# EasyEDA Pro project ProProject_USB-DAC-PRO_2024-02-27.epro, schematic DIGITAL

## Sheets
1 CT7601: Create Date: 2024-02-11; Page Name: CT7601; Project Name: USB-DAC-PRO; Schematic Name: DIGITAL; Update Date: 2024-02-13; Company: 嘉立创EDA; Page Size: A4; Version: V1.3
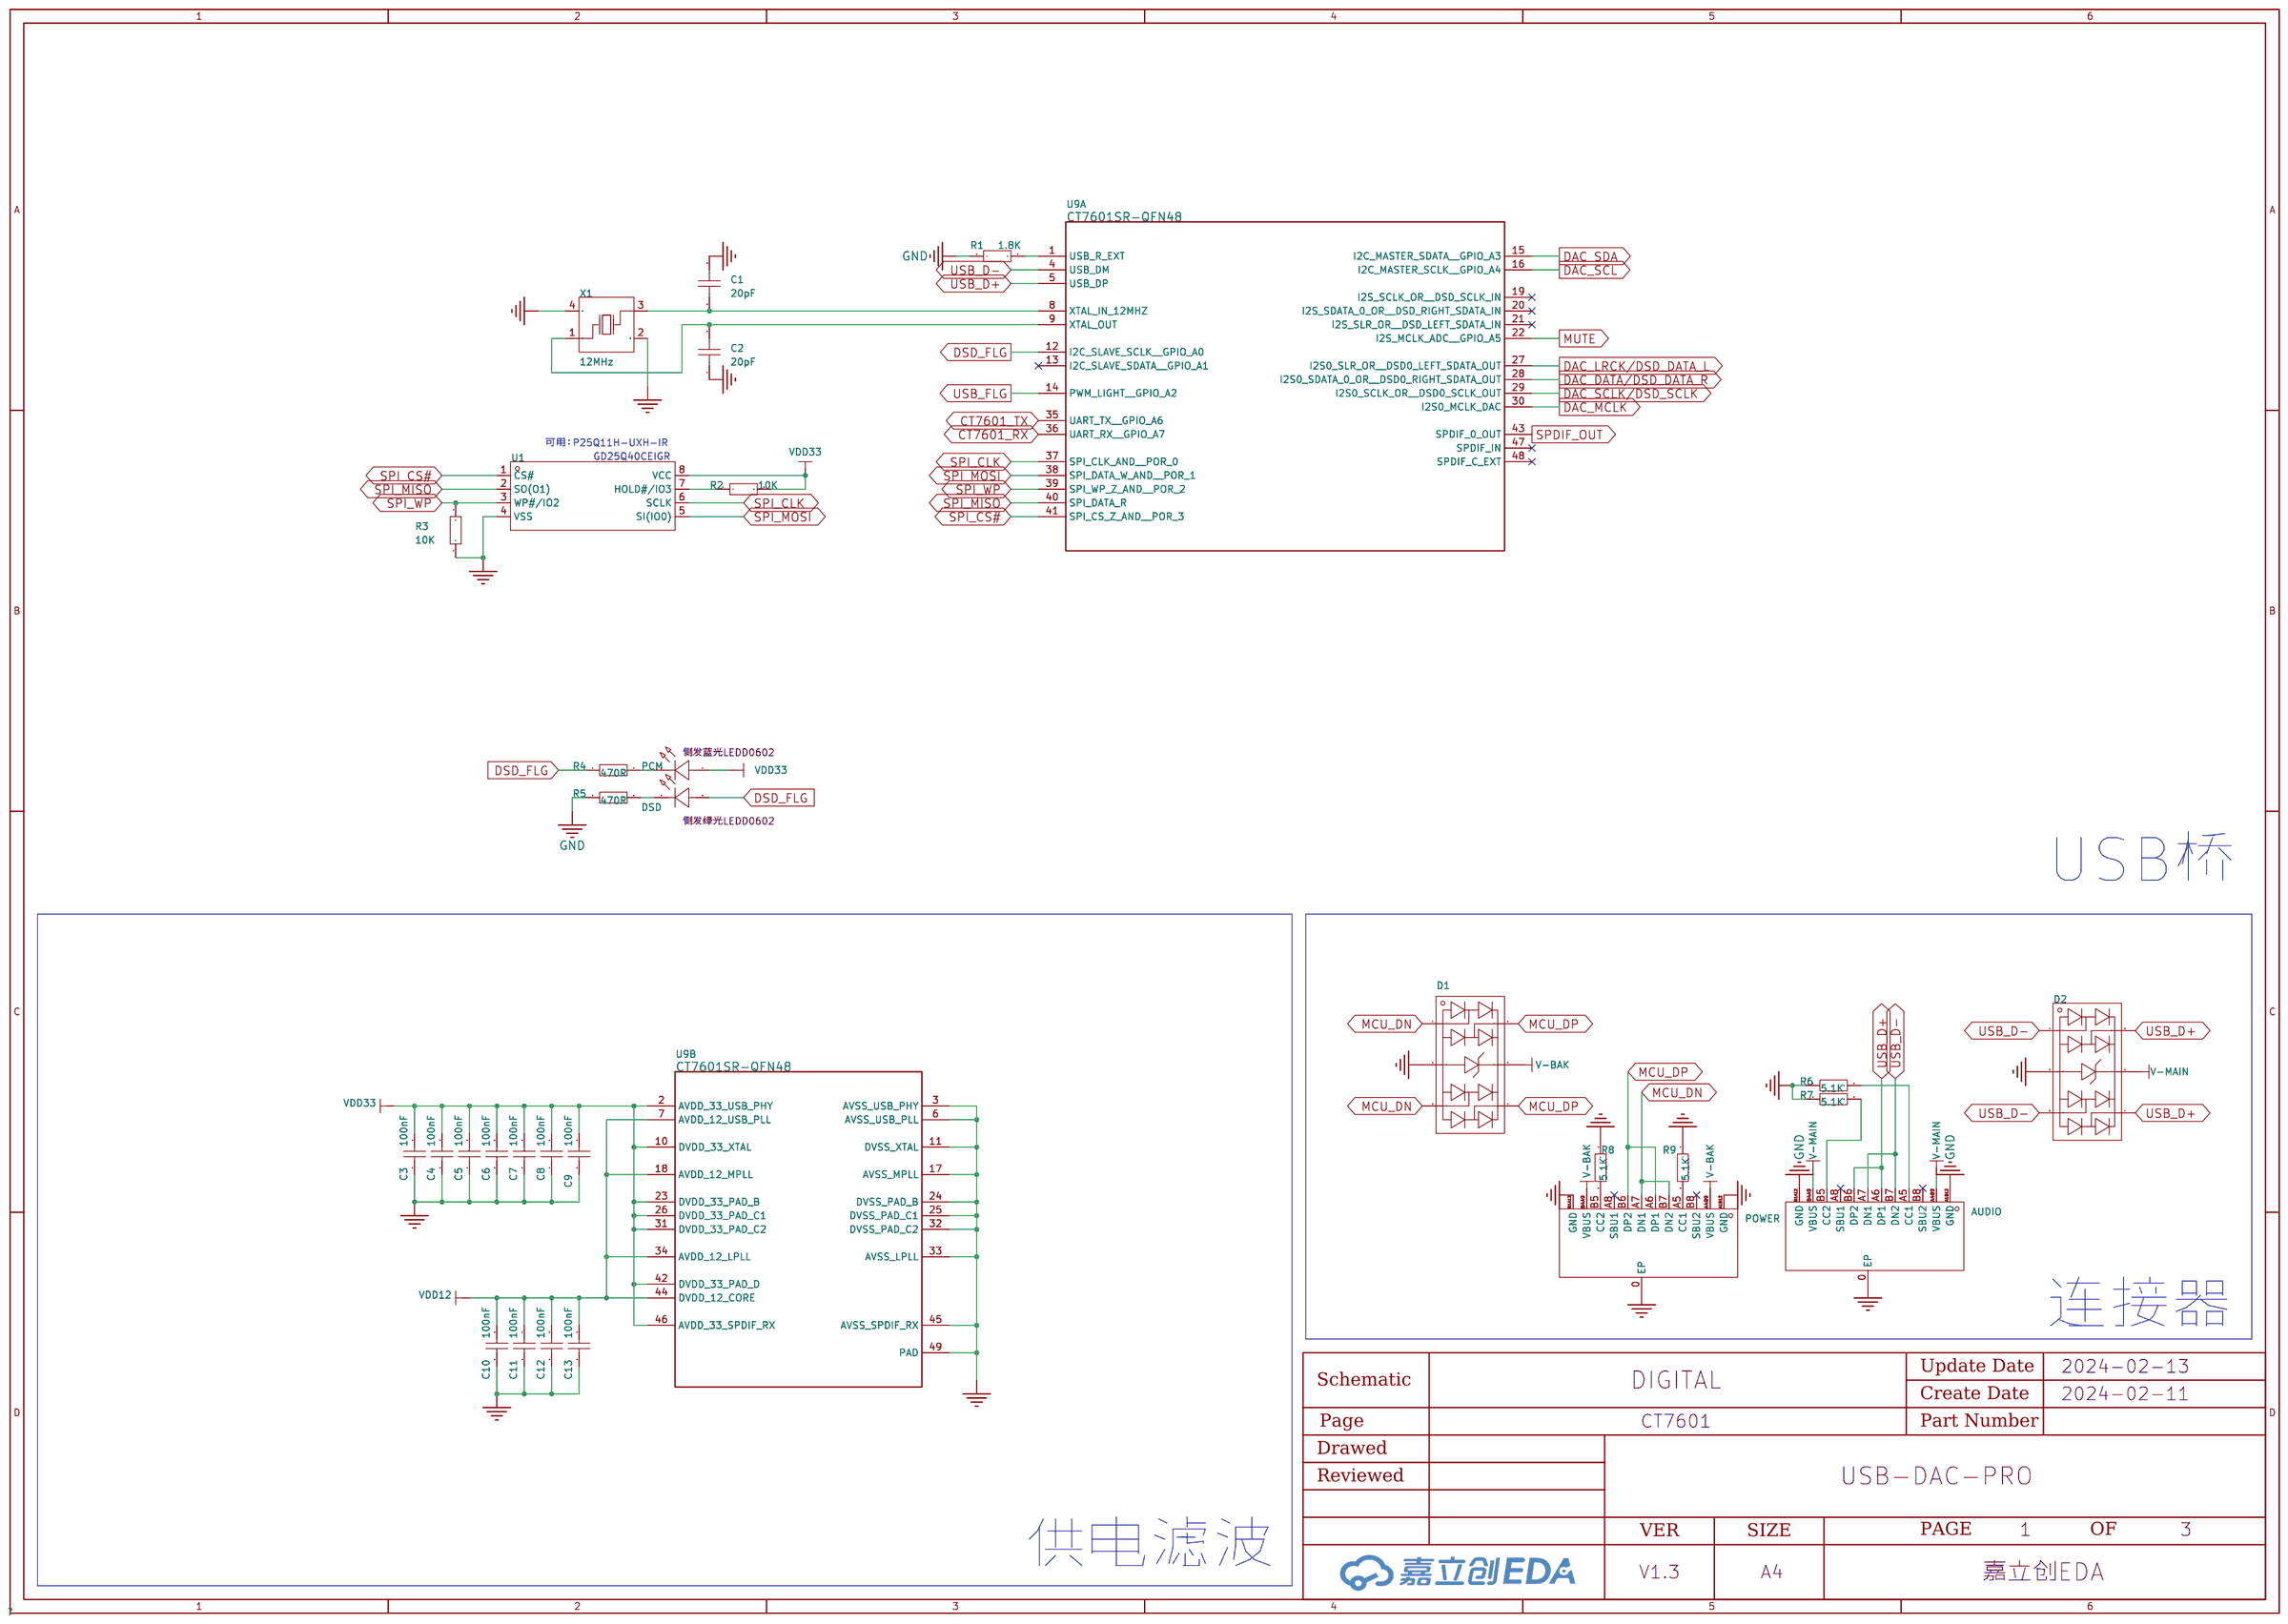
[diagram p3: CT7601]
2 POWER: Page Name: POWER; Update Date: 2024-02-22; Page Size: A3; Version: V1.0
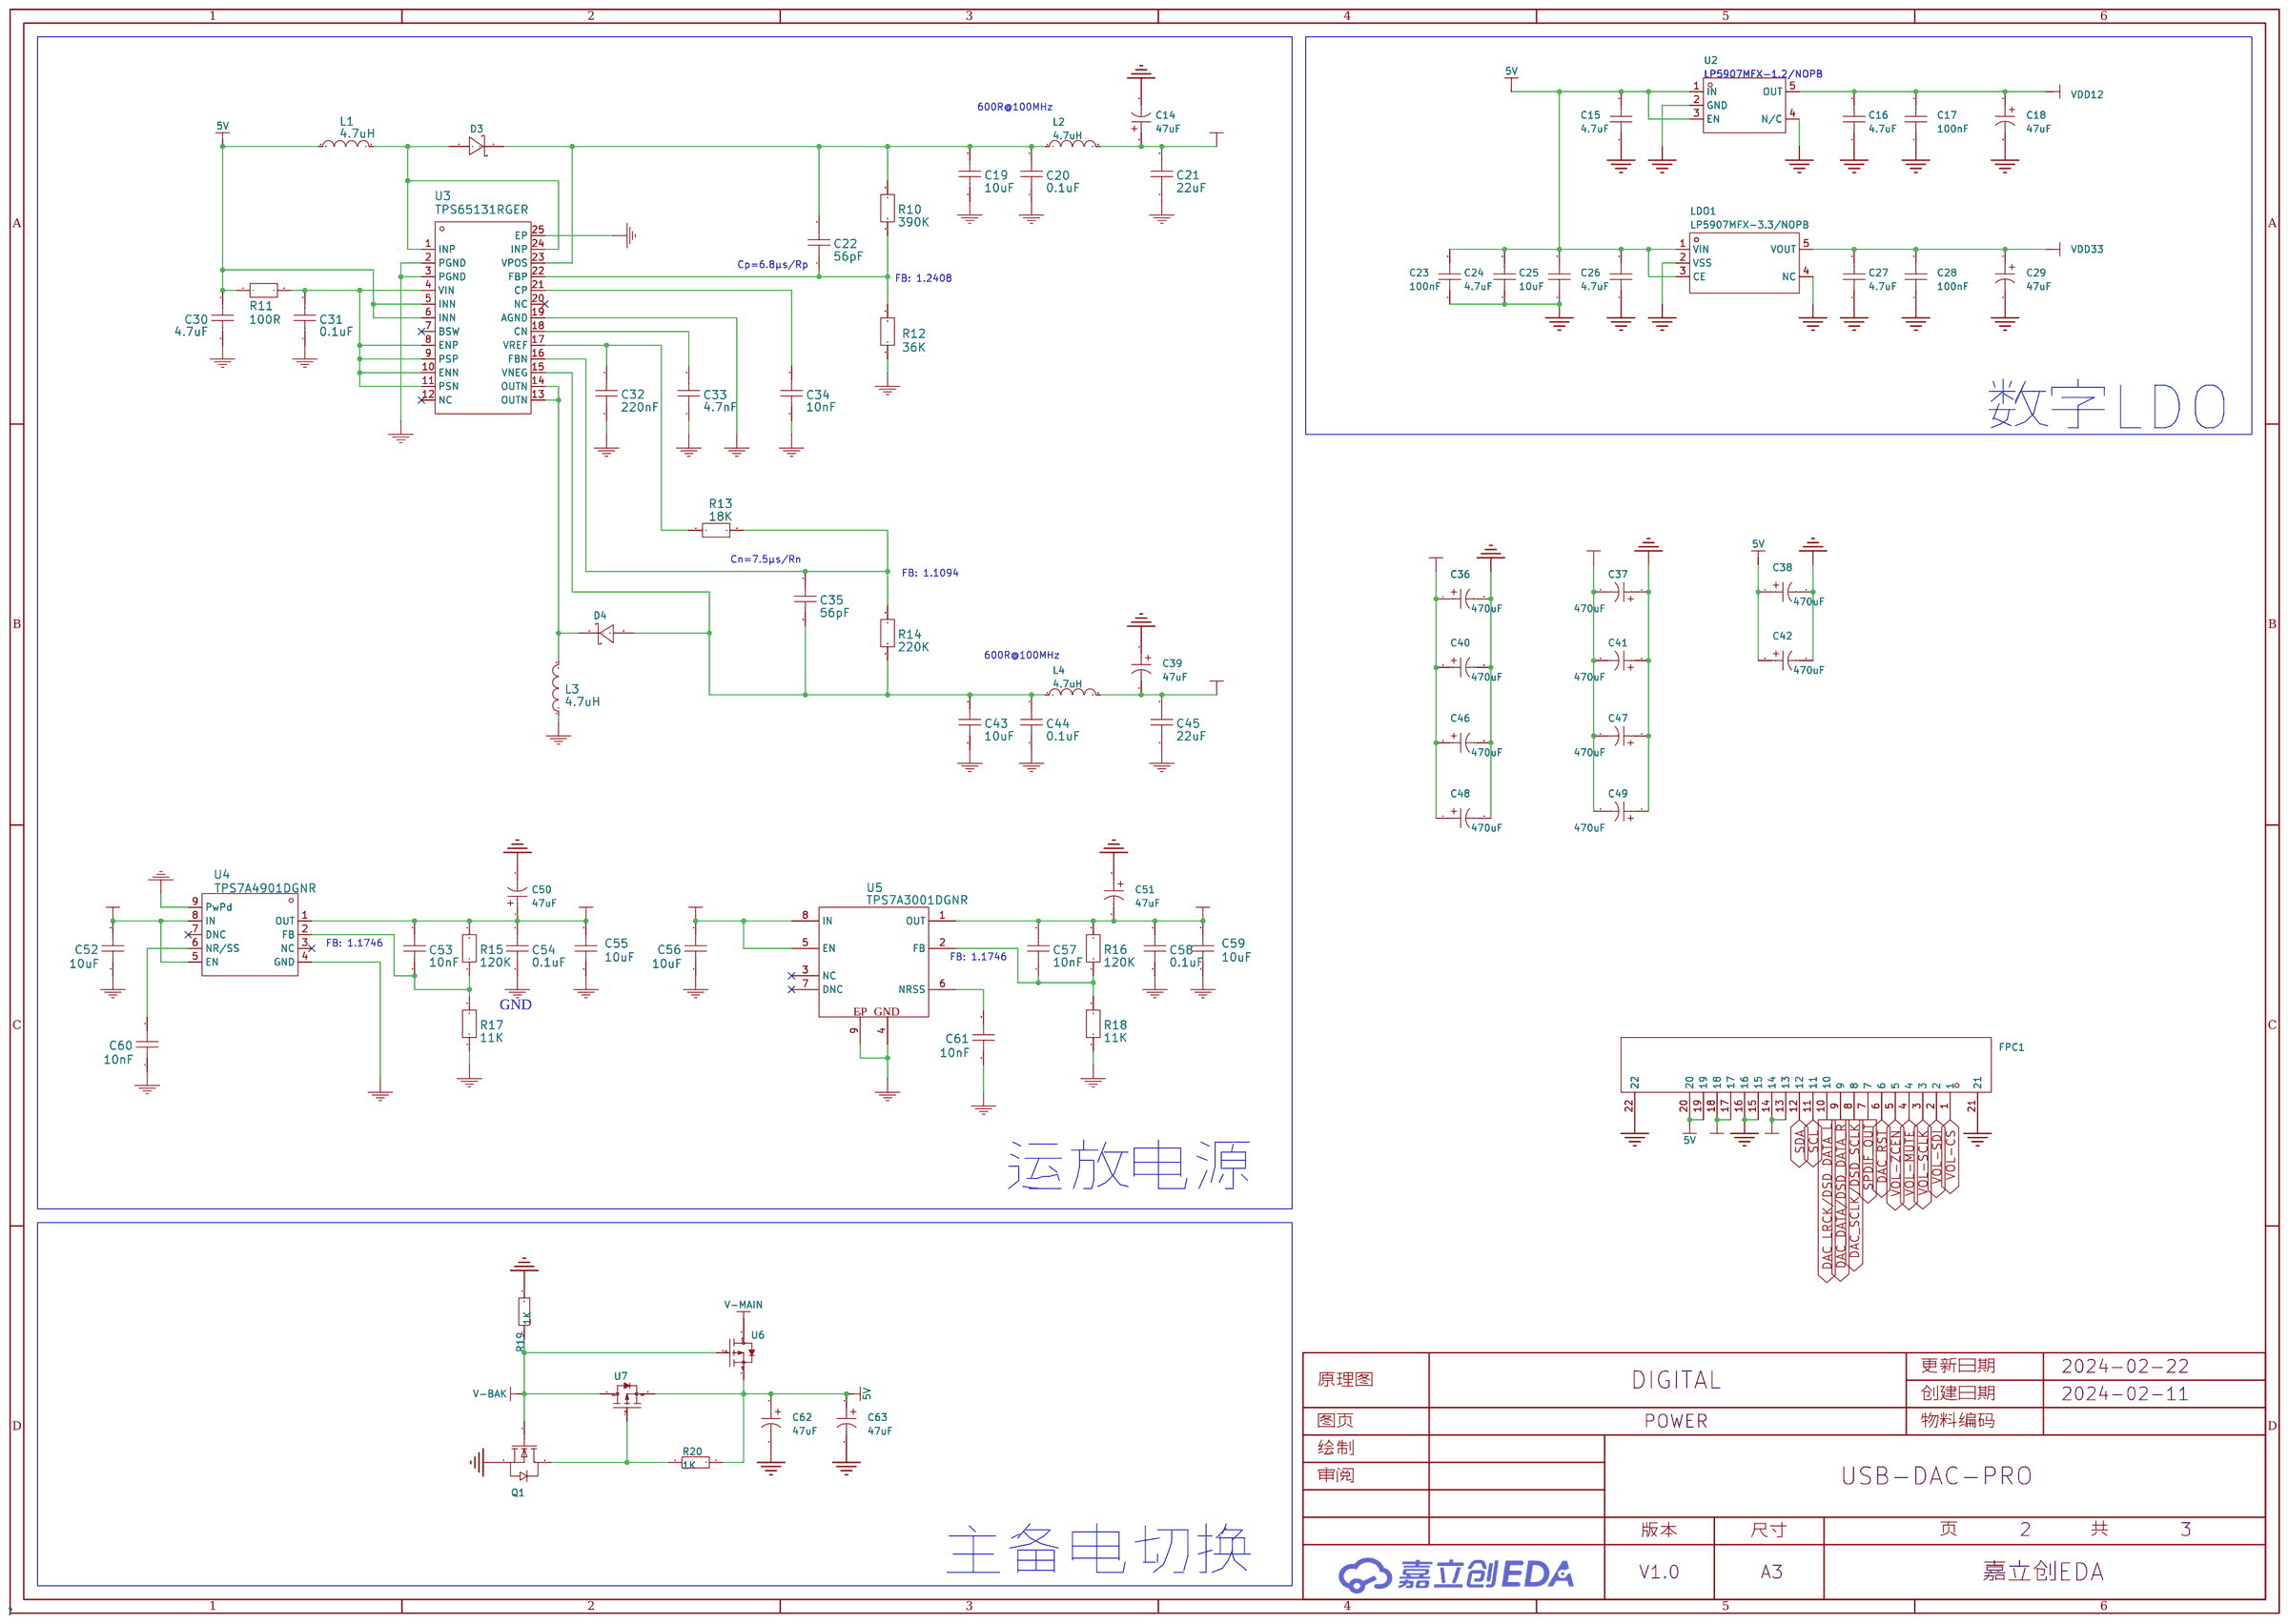
[diagram p4: POWER]
3 MCU: Page Name: MCU; Update Date: 2024-02-11; Page Size: A3; Version: V1.0
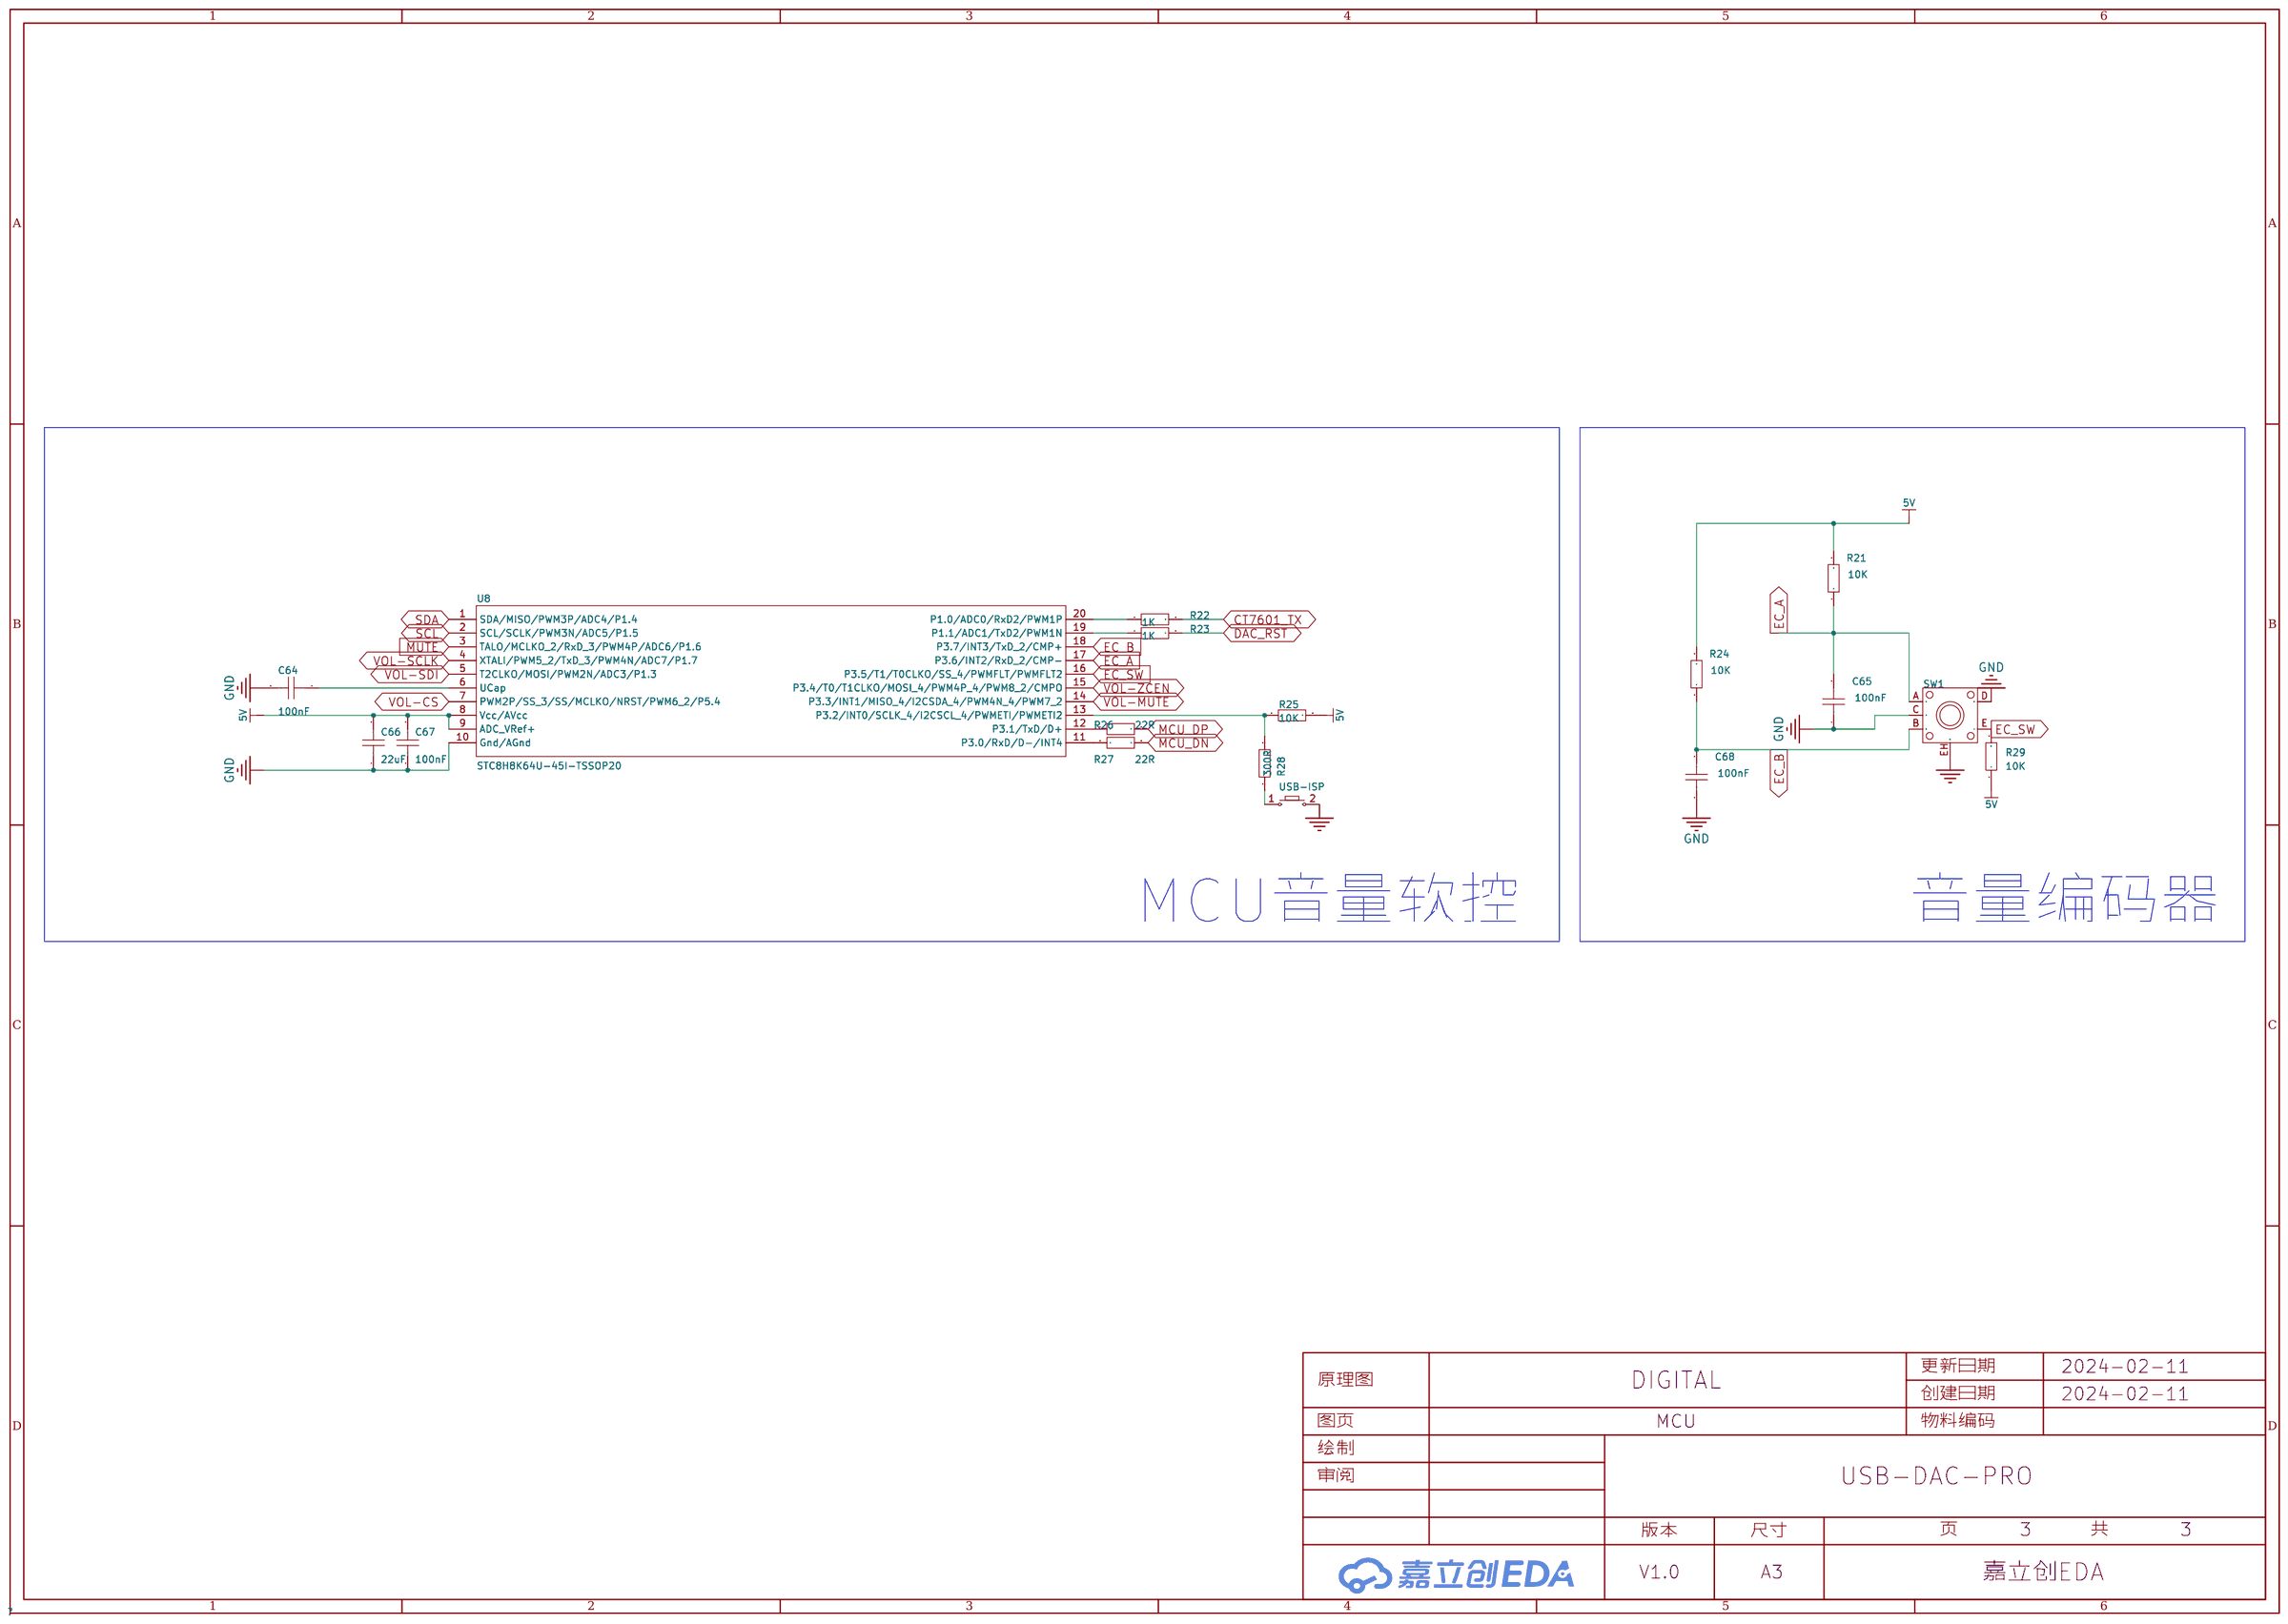
[diagram p5: MCU]

## Parts
sheet CT7601
AUDIO  CQ-USB- TYPE-C 16P母座四脚插板有柱  [USB-C-SMD_CQ-USB-TYPE-C]
C1  20pF  [C0603]
C2  20pF  [C0603]
C3  100nF  [C0603]
C4  100nF  [C0603]
C5  100nF  [C0603]
C6  100nF  [C0603]
C7  100nF  [C0603]
C8  100nF  [C0603]
C9  100nF  [C0603]
C10  100nF  [C0603]
C11  100nF  [C0603]
C12  100nF  [C0603]
C13  100nF  [C0603]
D1  TPUSBLC6-4SC6  [SOT-23-6_L2.9-W1.6-P0.95-LS2.8-BL]
D2  TPUSBLC6-4SC6  [SOT-23-6_L2.9-W1.6-P0.95-LS2.8-BL]
DSD  侧发绿光LEDD0602  [LED-SMD_L1.6-W1.1-R-RD_BLUE]
PCM  侧发蓝光LEDD0602  [LED-SMD_L1.6-W1.1-R-RD_BLUE]
POWER  CQ-USB- TYPE-C 16P母座四脚插板有柱  [USB-C-SMD_CQ-USB-TYPE-C]
R1  1.8K  [R0603]
R2  10K  [R0603]
R3  10K  [R0603]
R4  470R  [R0603]
R5  470R  [R0603]
R6  5.1K  [R0603]
R7  5.1K  [R0603]
R8  5.1K  [R0603]
R9  5.1K  [R0603]
U1  GD25Q40CSIGR  [SOP-8_L4.9-W3.9-P1.27-LS6.0-BR]
U9  CT7601SR-QFN48  [QFN-48_L6.0-W6.0-P0.40-TL-EP4.5]  (sections 1,2)
X1  12MHz  [OSC-SMD_4P-L3.2-W2.5-BL-1]
sheet MCU
C64  100nF  [C0603]
C65  100nF  [C0603]
C66  22uF  [C0603]
C67  100nF  [C0603]
C68  100nF  [C0603]
R21  10K  [R0603]
R22  1K  [R0603]
R23  1K  [R0603]
R24  10K  [R0603]
R25  10K  [R0603]
R26  22R  [R0603]
R27  22R  [R0603]
R28  300R  [R0603]
R29  10K  [R0603]
SW1  EC11B15242AZ  [SW-TH_EC11B1524XX]
U8  STC8H8K64U-45I-TSSOP20  [TSSOP-20_L6.5-W4.4-P0.65-LS6.4-BL]
USB-ISP  -  [Key_SMD_3x4x2]
sheet POWER
C14  47uF  [CAP-SMD_L3.5-W2.8-FD]
C15  4.7uF  [C0603]
C16  4.7uF  [C0603]
C17  100nF  [C0603]
C18  47uF  [CAP-SMD_L3.5-W2.8-FD]
C19  10uF  [C0603]
C20  0.1uF  [C0603]
C21  22uF  [C0603]
C22  56pF  [C0603]
C23  100nF  [C0603]
C24  4.7uF  [C0603]
C25  10uF  [C0603]
C26  4.7uF  [C0603]
C27  4.7uF  [C0603]
C28  100nF  [C0603]
C29  47uF  [CAP-SMD_L3.5-W2.8-FD]
C30  4.7uF  [C0603]
C31  0.1uF  [C0603]
C32  220nF  [C0603]
C33  4.7nF  [C0603]
C34  10nF  [C0603]
C35  56pF  [C0603]
C36  470uF  [CAP-TH_BD8.0-P3.50-D0.6-FD]
C37  470uF  [CAP-TH_BD8.0-P3.50-D0.6-FD]
C38  470uF  [CAP-TH_BD8.0-P3.50-D0.6-FD]
C39  47uF  [CAP-SMD_L3.5-W2.8-FD]
C40  470uF  [CAP-TH_BD8.0-P3.50-D0.6-FD]
C41  470uF  [CAP-TH_BD8.0-P3.50-D0.6-FD]
C42  470uF  [CAP-TH_BD8.0-P3.50-D0.6-FD]
C43  10uF  [C0603]
C44  0.1uF  [C0603]
C45  22uF  [C0603]
C46  470uF  [CAP-TH_BD8.0-P3.50-D0.6-FD]
C47  470uF  [CAP-TH_BD8.0-P3.50-D0.6-FD]
C48  470uF  [CAP-TH_BD8.0-P3.50-D0.6-FD]
C49  470uF  [CAP-TH_BD8.0-P3.50-D0.6-FD]
C50  47uF  [CAP-SMD_L3.5-W2.8-FD]
C51  47uF  [CAP-SMD_L3.5-W2.8-FD]
C52  10uF  [C0603]
C53  10nF  [C0603]
C54  0.1uF  [C0603]
C55  10uF  [C0603]
C56  10uF  [C0603]
C57  10nF  [C0603]
C58  0.1uF  [C0603]
C59  10uF  [C0603]
C60  10nF  [C0603]
C61  10nF  [C0603]
C62  47uF  [CAP-SMD_L3.5-W2.8-FD]
C63  47uF  [CAP-SMD_L3.5-W2.8-FD]
D3  SS34  [SMA_L4.3-W2.6-LS5.0-RD]
D4  SS34  [SMA_L4.3-W2.6-LS5.0-RD]
FPC1  AFA07-S20FCC-00  [FPC-SMD_AFA07-S20FCC-00]
L1  4.7uH  [IND-SMD_L5.9-W5.2_MAPM0530F]
L2  4.7uH  [L0603]
L3  4.7uH  [IND-SMD_L5.9-W5.2_MAPM0530F]
L4  4.7uH  [L0603]
LDO1  LP5907MFX-3.3/NOPB  [SOT-23-5_L3.0-W1.7-P0.95-LS2.8-BR]
Q1  AO3402  [SOT-23_L2.9-W1.3-P1.90-LS2.4-BR]
R10  390K  [R0603]
R11  100R  [R0603]
R12  36K  [R0603]
R13  18K  [R0603]
R14  220K  [R0603]
R15  120K  [R0603]
R16  120K  [R0603]
R17  11K  [R0603]
R18  11K  [R0603]
R19  1K  [R0603]
R20  1K  [R0603]
U2  LP5907MFX-1.2/NOPB  [SOT-23-5_L3.0-W1.7-P0.95-LS2.8-BR]
U3  TPS65131RGER  [QFN24_L]
U4  TPS7A4901DGNR  [MSOP-8_L3.0-W3.0-P0.65-LS5.0-BL-EP]
U5  TPS7A3001DGNR  [MSOP-8_L3.0-W3.0-P0.65-LS5.0-BL-EP]
U6  AO3401  [SOT-23-3_L2.9-W1.6-P1.90-LS2.8-BR]
U7  AO3401  [SOT-23-3_L2.9-W1.6-P1.90-LS2.8-BR]

## Library data of the parts
AUDIO POWER = CQ-USB- TYPE-C 16P母座四脚插板有柱: Supplier Part: C9900026759; Supplier Footprint: USB-TYPE-C-SMD-16P; JLCPCB Part Class: 扩展库; Datasheet: https://atta.szlcsc.comnull; Supplier: LCSC
C1 C2 C17 C28 = CAP_0603: Supplier Footprint: 0603
C3-C13 = CC0402KRX5R9BB104: 容值:100nF;精度:±10%;额定电压:50V;材质(温度系数):X5R;; LCSC Part Name: 100nF ±10% 50V; Supplier Part: C105882; Manufacturer: YAGEO(国巨); Supplier Footprint: 0402; JLCPCB Part Class: 扩展库; Datasheet: https://atta.szlcsc.com/upload/public/pdf/source/20170728/C105882_1501225683175848715.pdf; Supplier: LCSC; Tolerance: ±10%; Voltage Rated: 50V; Temperature Coefficient: X5R
D1 D2 = TPUSBLC6-4SC6: Supplier Part: C558419; Manufacturer: TECH PUBLIC(台舟); Supplier Footprint: SOT-23-6; JLCPCB Part Class: 扩展库; Datasheet: https://atta.szlcsc.com/upload/public/pdf/source/20210810/1DCA85282029FC361C514A719682E0A3.pdf; Supplier: LCSC
DSD PCM = 侧发蓝光LEDD0602: Supplier Part: C9900011662; JLCPCB Part Class: 扩展库; Datasheet: https://atta.szlcsc.comnull; Supplier: LCSC
R1 = RC0402JR-071K8L: 电阻类型:厚膜电阻;阻值:1.8kΩ;精度:±5%;功率:62.5mW;温度系数:±100ppm/℃;最大工作电压:50V;工作温度范围:-55℃~+155℃;; LCSC Part Name: 1.8kΩ ±5% 62.5mW; Supplier Part: C137909; Manufacturer: YAGEO(国巨); Supplier Footprint: 0402; JLCPCB Part Class: 扩展库; Datasheet: https://atta.szlcsc.com/upload/public/pdf/source/20171107/C137909_15100515623851096840.pdf; Supplier: LCSC; Type: 厚膜电阻; Tolerance: ±5%; Power(Watts): 62.5mW; Temperature Coefficient: ±100ppm/℃; Overload Voltage (Max): 50V; Operating Temperature Range: -55℃~+155℃
R2 R3 = RC0402FR-0710KL: 最大工作电压:50V;阻值:10kΩ;工作温度范围:-55℃~+155℃;电阻长:-;精度:±1%;电阻直径:-;电阻高:-;电阻宽:-;电阻类型:厚膜电阻;功率:62.5mW;温度系数:±100ppm/℃;; LCSC Part Name: 10kΩ ±1%; Supplier Part: C60490; Manufacturer: YAGEO(国巨); Supplier Footprint: 0402; JLCPCB Part Class: 扩展库; Datasheet: https://atta.szlcsc.com/upload/public/pdf/source/20170606/1496716515432.pdf; Supplier: LCSC; Overload Voltage (Max): 50V; Operating Temperature Range: -55℃~+155℃; Tolerance: ±1%; Type: 厚膜电阻; Power(Watts): 62.5mW; Temperature Coefficient: ±100ppm/℃
R4 R5 = RC0402FR-07470RL: 阻值:470Ω;最大工作电压:50V;工作温度范围:-55℃~+155℃;电阻长:-;精度:±1%;电阻直径:-;电阻高:-;电阻宽:-;电阻类型:厚膜电阻;功率:62.5mW;温度系数:±100ppm/℃;; LCSC Part Name: 470Ω ±1%; Supplier Part: C114877; Manufacturer: YAGEO(国巨); Supplier Footprint: 0402; JLCPCB Part Class: 扩展库; Datasheet: https://atta.szlcsc.com/upload/public/pdf/source/20170912/C114877_1505207821835963485.pdf; Supplier: LCSC; Overload Voltage (Max): 50V; Operating Temperature Range: -55℃~+155℃; Tolerance: ±1%; Type: 厚膜电阻; Power(Watts): 62.5mW; Temperature Coefficient: ±100ppm/℃
R6 R7 = RC0402JR-075K1L: 功率:1/16W;精度:±5%;温度系数:±100ppm/℃;阻值:5.1kΩ;最大工作电压:50V;工作温度范围:-55℃~+155℃;; LCSC Part Name: 5.1kΩ ±5%; Supplier Part: C105873; Manufacturer: YAGEO(国巨); Supplier Footprint: 0402; JLCPCB Part Class: 扩展库; Datasheet: https://atta.szlcsc.com/upload/public/pdf/source/20170912/C105873_1505207465225963230.pdf; Supplier: LCSC; Power(Watts): 1/16W; Tolerance: ±5%; Temperature Coefficient: ±100ppm/℃; Overload Voltage (Max): 50V; Operating Temperature Range: -55℃~+155℃
R8 R9 R19-R28 = Res_0603: Supplier Footprint: 0603
U1 = GD25Q40CSIGR: Supplier Part: C395467; Manufacturer: GigaDevice(兆易创新); Supplier Footprint: SOP-8-208mil; JLCPCB Part Class: 扩展库; Datasheet: https://atta.szlcsc.com/upload/public/pdf/source/20191108/C395467_F2541705A2208B93013D5E9CF59820A7.pdf; Supplier: LCSC
U9 = CT7601SR: Audio interface; Supplier: TB; Manufacturer: Comtrue
X1 = X322524MOB4SI: 晶振类型:贴片无源晶振;频率:24MHz;频率公差:±10ppm;频率稳定度:±30ppm;负载电容:12pF;工作温度:-40℃~+85℃;; LCSC Part Name: YSX321SL 24MHz ±10ppm 12pF; Supplier Part: C70590; Manufacturer: YXC(扬兴晶振); Supplier Footprint: SMD3225-4P; JLCPCB Part Class: Extended Part; Datasheet: https://atta.szlcsc.com/upload/public/pdf/source/20210329/C112971_1F611BDC486E193C1706F6D8EB5AA189.pdf; Supplier: LCSC; Crystal Type: 贴片无源晶振; Frequency Tolerance: ±10ppm; Frequency Stability: ±30ppm; Load Capacitance: 12pF; Operating Temperature: -40℃~+85℃
C64-C68 = CAP_0603: 容值:100nF;精度:±10%;额定电压:50V;温度系数:X7R;; Supplier Footprint: 0603
R29 = Res_0402: Supplier Footprint: 0402
SW1 = EC11B15242AZ: LCSC Part Name: EC11B15242AZ 三件套; Supplier Part: C470746; Manufacturer: ALPSALPINE(阿尔卑斯阿尔派); Supplier Footprint: 插件; JLCPCB Part Class: 扩展库; Datasheet: https://atta.szlcsc.com/upload/public/pdf/source/20191216/C470746_9507421D5AADEF16632835A9B02BB053.pdf; Supplier: LCSC
U8 = STC8H8K64U-45I-TSSOP20
USB-ISP = Key_SMD_3x4x2: Supplier Footprint: SMD
C14 C18 C29 C39 C50 C51 C62 C63 = T55B476M6R3C0070: 容值:47uF;精度:±20%;额定电压:6.3V;等效串联电阻:70mΩ@100kHz;; LCSC Part Name: 47uF ±20% 6.3V; Supplier Part: C2158713; Manufacturer: VISHAY(威世); Supplier Footprint: 1411; JLCPCB Part Class: 扩展库; Datasheet: https://atta.szlcsc.com/upload/public/pdf/source/20210427/369E0E2B82AAAC68C140254C20AD9476.pdf; Supplier: LCSC; Tolerance: ±20%; Rated Voltage: 6.3V; Equivalent Series Resistance(ESR): 70mΩ@100kHz; Operating Temperature: -55℃~+105℃
C15 C16 C23-C27 = CL10A106MP8NNNC: 容值:10uF;精度:±20%;额定电压:10V;材质(温度系数):X5R;; LCSC Part Name: 10uF ±20% 10V; Supplier Part: C85713; Manufacturer: SAMSUNG(三星); Supplier Footprint: 0603; JLCPCB Part Class: 扩展库; Datasheet: https://atta.szlcsc.com/upload/public/pdf/source/20161027/1477535406017.pdf; Supplier: LCSC; Tolerance: ±20%; Voltage Rated: 10V; Temperature Coefficient: X5R
C19 C43 C52 C55 C56 C59-C61 = 10uF_C0805
C20 C44 C54 C58 = 0.1uF_C0805
C21 = 22uF
C22 = 6.8pF
C30 = 4.7uF_C0805
C31 = 100nF
C32 = 220nF
C33 = 4.7nF
C34 = 10nF
C35 = 7.5pF
C36-C38 C40-C42 C46-C49 = SPT1CM471F09OR: 容值:470uF;精度:±20%;额定电压:16V;纹波电流:-;等效串联电阻:-;类型:-;; LCSC Part Name: 470uF ±20% 16V; Supplier Part: C556223; Manufacturer: Yunxing(云星); Supplier Footprint: 插件,D8xL9mm; JLCPCB Part Class: 扩展库; Datasheet: https://atta.szlcsc.com/upload/public/pdf/source/20200519/C556210_20849F4C71C30C295F8AE8152F629B71.pdf; Supplier: LCSC; Tolerance: ±20%; Rated Voltage: 16V; Lead Spacing: 3.5mm; φD: 8mm; L: 9mm; Lifetime @ Temp: 2000hrs@105℃; Operating Temperature: -55℃~+105℃
C45 = 22uF_C0805
C53 C57 = 10nF_C0805
D3 D4 = SS34: Supplier Part: C9900023345; Supplier Footprint: SMA,DO-214AC; JLCPCB Part Class: 扩展库; Datasheet: 2022-07-04/534833A/5ff3008f79ea4c6ab22b1f3463cee262/20210714020425519.pdf; Supplier: LCSC
FPC1 = AFA07-S20FCC-00: 锁定特性:抽屉式;触点类型:下接;触点数量:20P;间距:1mm;安装类型:卧贴;; LCSC Part Name: 间距:1mm P数:20P 抽屉式 下接; Supplier Part: C262352; Manufacturer: JS(钜硕电子); Supplier Footprint: SMD,P=1mm,卧贴; JLCPCB Part Class: 扩展库; Datasheet: https://atta.szlcsc.com/upload/public/pdf/source/20191217/C262716_30B15E9A77BFCA4A54741C92DB3BE8CC.pdf; Supplier: LCSC; Locking Feature: 抽屉式; Contact Type: 下接; Number of Contacts: 20P; Pitch: 1mm; Mounting Type: 卧贴; FFC, FCB Thickness: 0.3mm; Height Above Board: 2.5mm
L1 = 4.7uH_IND-SMD_L5.9-W5.2_MAPM0530F: Supplier: LCSC; Supplier Part: C696440; Manufacturer: microgate; Manufacturer Part: MAPM0530F-2R2M-LF; JLCPCB Part Class: Extended Part
L2 L4 = L_0805_US: 电感值:10uH;精度:±10%;额定电流:15mA;饱和电流(Isat):-;直流电阻(DCR):1.15Ω;; Supplier Footprint: L0805
L3 = 4.7uH: Supplier: LCSC; Supplier Part: C696440; Manufacturer: microgate; Manufacturer Part: MAPM0530F-2R2M-LF; JLCPCB Part Class: Extended Part
LDO1 = LP5907MFX-3.3/NOPB: 输出类型:固定;输出极性:正;输出通道数:1;最大输入电压:5.5V;输出电压:3.3V;压差:250mV@(250mA);输出电流:250mA;电源纹波抑制比(PSRR):90dB;; LCSC Part Name: 正 Vin=5.5V Vout=3.3V 250mA 90dB; Supplier Part: C80670; Manufacturer: TI(德州仪器); Supplier Footprint: SOT-23-5; JLCPCB Part Class: Extended Part; Datasheet: https://atta.szlcsc.com/upload/public/pdf/source/20160830/1472551528598.pdf; Supplier: LCSC; Output Type: 固定; Output Polarity: 正; Number of Outputs: 1; Maximum Input Voltage: 5.5V; Output Voltage: 3.3V; Dropout Voltage: 250mV@(250mA); Output Current: 250mA; Power Supply Rejection Ratio (PSRR): 90dB; Power Supply Rejection Ratio (PRSS): 70dB@(1kHz),62dB@(10kHz)
Q1 = AO3402: 类型:N沟道;漏源电压(Vdss):30V;连续漏极电流(Id):4A;功率(Pd):1.4W;导通电阻(RDS(on)@Vgs,Id):55mΩ@10V,4A;; LCSC Part Name: N沟道 30V 4A; Supplier Part: C14385; Manufacturer: AOS; Supplier Footprint: SOT-23; JLCPCB Part Class: 扩展库; Datasheet: https://atta.szlcsc.com/upload/public/pdf/source/20171023/C14385_15087455190191052858.pdf; Supplier: LCSC; Type: N沟道; Drain Source Voltage (Vdss): 30V; Continuous Drain Current (Id): 4A; Power Dissipation (Pd): 1.4W; Drain Source On Resistance (RDS(on)@Vgs,Id): 55mΩ@10V,4A; Gate Threshold Voltage (Vgs(th)@Id): 1.4V@250uA; Total Gate Charge (Qg@Vgs): 4.34nC@4.5V; Input Capacitance (Ciss@Vds): 390pF@15V; Operating Temperature: -55℃~+150℃@(Tj)
R10 = 1M
R11 = 100R
R12 = 84.5K
R13 = 80.6K
R14 = 1M_R0805
R15 R16 = 470K_R0805
R17 = 51K
R18 = 51K_R0805
U2 = LP5907MFX-1.2/NOPB: 输出类型:固定;输出极性:正;最大输入电压:5.5V;输出电压:1.2V;输出电流:250mA;电源纹波抑制比(PSRR):90dB;; LCSC Part Name: 输入5.5V 输出1.2V~1.2V 250mA; Supplier Part: C73478; Manufacturer: TI(德州仪器); Supplier Footprint: SOT-23-5; JLCPCB Part Class: 扩展库; Datasheet: https://www.ti.com/cn/lit/gpn/lp5907; Supplier: LCSC; Output Type: 固定; Output Polarity: 正; Number of Outputs: 1; Maximum Input Voltage: 5.5V; Output Voltage: 1.2V; Dropout Voltage: 250mV@(250mA); Quiescent Current (Ground Current): 25uA; Output Current: 250mA; Power Supply Rejection Ratio (PSRR): 90dB; Operating Temperature: -40℃~+125℃
U3 = TPS65131RGER: Supplier: LCSC; Manufacturer: TI; Supplier Part: C87663; JLCPCB Part Class: Extend
U4 = TPS7A4901DGNR: Supplier: LCSC; Manufacturer: TI; Supplier Part: C16430; JLCPCB Part Class: Extended Part
U5 = TPS7A3001DGNR: Supplier: LCSC; Manufacturer: TI; Supplier Part: C33835; JLCPCB Part Class: Extended Part
U6 U7 = AO3401: Supplier Part: C9900008520; Supplier Footprint: SOT-23; JLCPCB Part Class: 扩展库; Datasheet: 2022-02-24/534833A/2fb8c9c28af74bcb93991a83fa8940a9/AO3401.pdf; Supplier: LCSC

## Nets
5V: C15.2 C23.2 C24.2 C25.2 C26.2 C30.1 C38.1 C42.1 C62.1 C63.1 C66.2 C67.2 FPC1.19 FPC1.20 L1.1 LDO1.1(VIN) LDO1.3(CE) R11.1 R20.2 R21.2 R24.2 R25.2 R29.1 U2.1(IN) U2.3(EN) U3.5(INN) U3.6(INN) U6.2(S) U7.2(S) U8.8(Vcc/AVcc) U8.9(ADC_VRef+)
+15V: C14.1 C21.2 C52.2 L2.2 U4.5(EN) U4.8(IN)
-15V: C39.2 C45.2 C56.2 L4.2 U5.5(EN) U5.8(IN)
GND: AUDIO.0(EP) AUDIO.A1B12(GND) AUDIO.B1A12(GND) C1.2 C2.1 C3.1 C4.1 C5.1 C6.1 C7.1 C8.1 C9.1 C10.1 C11.1 C12.1 C13.1 C14.2 C15.1 C16.1 C17.1 C18.2 C19.1 C20.1 C21.1 C23.1 C24.1 C25.1 C26.1 C27.1 C28.1 C29.2 C30.2 C31.1 C32.1 C33.1 C34.1 C36.2 C37.1 C38.2 C39.1 C40.2 C41.1 C42.2 C43.1 C44.1 C45.1 C46.2 C47.1 C48.2 C49.1 C50.2 C51.1 C52.1 C54.1 C55.1 C56.1 C58.1 C59.1 C60.1 C61.1 C62.2 C63.2 C64.2 C65.1 C66.1 C67.1 C68.1 D1.2 D2.2 FPC1.15 FPC1.16 FPC1.21 FPC1.22 L3.1 LDO1.2(VSS) LDO1.4(NC) POWER.0(EP) POWER.A1B12(GND) POWER.B1A12(GND) Q1.2(S) R1.1 R3.1 R5.1 R6.1 R7.1 R8.1 R9.1 R12.1 R17.1 R18.1 R19.2 SW1.C SW1.D SW1.EH U1.4(VSS) U2.2(GND) U2.4(N/C) U3.2(PGND) U3.3(PGND) U3.19(AGND) U3.25(EP) U4.4(GND) U4.9(PwPd) U5.4(GND) U5.9(EP) U8.10(Gnd/AGnd) U9.3(AVSS_USB_PHY) U9.6(AVSS_USB_PLL) U9.11(DVSS_XTAL) U9.17(AVSS_MPLL) U9.24(DVSS_PAD_B) U9.25(DVSS_PAD_C1) U9.32(DVSS_PAD_C2) U9.33(AVSS_LPLL) U9.45(AVSS_SPDIF_RX) U9.49(PAD) USB-ISP.2 X1.2(GND) X1.4(GND)
VDD12: C10.2 C11.2 C12.2 C13.2 C16.2 C17.2 C18.1 U2.5(OUT) U9.7(AVDD_12_USB_PLL) U9.18(AVDD_12_MPLL) U9.34(AVDD_12_LPLL) U9.44(DVDD_12_CORE)
VDD33: C3.2 C4.2 C5.2 C6.2 C7.2 C8.2 C9.2 C27.2 C28.2 C29.1 LDO1.5(VOUT) PCM.1(A) R2.2 U1.8(VCC) U9.2(AVDD_33_USB_PHY) U9.10(DVDD_33_XTAL) U9.23(DVDD_33_PAD_B) U9.26(DVDD_33_PAD_C1) U9.31(DVDD_33_PAD_C2) U9.42(DVDD_33_PAD_D) U9.46(AVDD_33_SPDIF_RX)
+VO: C36.1 C40.1 C46.1 C48.1 C50.1 C53.2 C54.2 C55.2 FPC1.13 FPC1.14 R15.2 U4.1(OUT)
-VO: C37.2 C41.2 C47.2 C49.2 C51.2 C57.2 C58.2 C59.2 FPC1.17 FPC1.18 R16.2 U5.1(OUT)
CT7601_RX: U9.36(UART_RX _GPIO_A7)
CT7601_TX: R22.2 U9.35(UART_TX _GPIO_A6)
DAC_DATA/DSD_DATA_R: FPC1.9 U9.28(I2S0_SDATA_0_OR _DSD0_RIGHT_SDATA_OUT)
DAC_LRCK/DSD_DATA_L: FPC1.10 U9.27(I2S0_SLR_OR _DSD0_LEFT_SDATA_OUT)
DAC_MCLK: U9.30(I2S0_MCLK_DAC)
DAC_RST: FPC1.6 R23.2
DAC_SCL: U9.16(I2C_MASTER_SCLK _GPIO_A4)
DAC_SCLK/DSD_SCLK: FPC1.8 U9.29(I2S0_SCLK_OR _DSD0_SCLK_OUT)
DAC_SDA: U9.15(I2C_MASTER_SDATA _GPIO_A3)
DSD_FLG: DSD.1(A) R4.1 U9.12(I2C_SLAVE_SCLK _GPIO_A0)
EC_A: C65.2 R21.1 SW1.A U8.17(P3.6/INT2/RxD_2/CMP-)
EC_B: C68.2 R24.1 SW1.B U8.18(P3.7/INT3/TxD_2/CMP+)
EC_SW: R29.2 SW1.E U8.16(P3.5/T1/T0CLKO/SS_4/PWMFLT/PWMFLT2)
MCU_DN: D1.1 D1.3 POWER.A7(DN1) POWER.B7(DN2) R27.2
MCU_DP: D1.4 D1.6 POWER.A6(DP1) POWER.B6(DP2) R26.2
MUTE: U8.3(TALO/MCLKO_2/RxD_3/PWM4P/ADC6/P1.6) U9.22(I2S_MCLK_ADC _GPIO_A5)
SCL: FPC1.11 U8.2(SCL/SCLK/PWM3N/ADC5/P1.5)
SDA: FPC1.12 U8.1(SDA/MISO/PWM3P/ADC4/P1.4)
SPDIF_OUT: FPC1.7 U9.43(SPDIF_0_OUT)
SPI_CLK: U1.6(SCLK) U9.37(SPI_CLK_AND _POR_0)
SPI_CS#: U1.1(CS#) U9.41(SPI_CS_Z_AND _POR_3)
SPI_MISO: U1.2(SO(O1)) U9.40(SPI_DATA_R)
SPI_MOSI: U1.5(SI(IO0)) U9.38(SPI_DATA_W_AND _POR_1)
SPI_WP: R3.2 U1.3(WP#/IO2) U9.39(SPI_WP_Z_AND _POR_2)
USB_D+: AUDIO.A6(DP1) AUDIO.B6(DP2) D2.4 D2.6 U9.5(USB_DP)
USB_D-: AUDIO.A7(DN1) AUDIO.B7(DN2) D2.1 D2.3 U9.4(USB_DM)
USB_FLG: U9.14(PWM_LIGHT _GPIO_A2)
V-BAK: D1.5 POWER.A4B9(VBUS) POWER.B4A9(VBUS) Q1.1(G) R19.1 U6.1(G) U7.3(D)
V-MAIN: AUDIO.A4B9(VBUS) AUDIO.B4A9(VBUS) D2.5 U6.3(D)
VOL-CS: FPC1.1 U8.7(PWM2P/SS_3/SS/MCLKO/NRST/PWM6_2/P5.4)
VOL-MUTE: FPC1.4 U8.14(P3.3/INT1/MISO_4/I2CSDA_4/PWM4N_4/PWM7_2)
VOL-SCLK: FPC1.3 U8.4(XTALI/PWM5_2/TxD_3/PWM4N/ADC7/P1.7)
VOL-SDI: FPC1.2 U8.5(T2CLKO/MOSI/PWM2N/ADC3/P1.3)
VOL-ZCEN: FPC1.5 U8.15(P3.4/T0/T1CLKO/MOSI_4/PWM4P_4/PWM8_2/CMPO)
$1N2972: R1.2 U9.1(USB_R_EXT)
$1N5430: R2.1 U1.7(HOLD#/IO3)
$1N28291: C2.2 U9.9(XTAL_OUT) X1.1(OSC1)
$1N28304: C1.1 U9.8(XTAL_IN_12MHZ) X1.3(OSC2)
$1N42418: AUDIO.A5(CC1) R6.2
$1N42422: AUDIO.B5(CC2) R7.2
$1N47108: POWER.A5(CC1) R9.2
$1N47109: POWER.B5(CC2) R8.2
$1N48705: DSD.2(K) R5.2
$1N48706: PCM.2(K) R4.2
$5N7404: C22.1 R10.1 R12.2 U3.22(FBP)
$5N7405: D3.2(A) L1.2 U3.1(INP) U3.24(INP)
$5N7406: C31.2 R11.2 U3.4(VIN) U3.8(ENP) U3.9(PSP) U3.10(ENN) U3.11(PSN)
$5N7408: D4.1(K) L3.2 U3.13(OUTN) U3.14(OUTN)
$5N7410: C33.2 U3.18(CN)
$5N7416: C34.2 U3.21(CP)
$5N7417: C32.2 R13.1 U3.17(VREF)
$5N7419: C60.2 U4.6(NR/SS)
$5N7421: C53.1 R15.1 R17.2 U4.2(FB)
$5N7426: C61.2 U5.6(NRSS)
$5N7428: C57.1 R16.1 R18.2 U5.2(FB)
$5N7706: Q1.3(D) R20.1 U7.1(G)
$5N10266: C35.2 R13.2 R14.2 U3.16(FBN)
$5N24892: C35.1 C43.2 C44.2 D4.2(A) L4.1 R14.1 U3.15(VNEG)
$5N24922: C19.2 C20.2 C22.2 D3.1(K) L2.1 R10.2 U3.23(VPOS)
$7N698: C64.1 U8.6(UCap)
$7N703: R25.1 R28.2 U8.13(P3.2/INT0/SCLK_4/I2CSCL_4/PWMETI/PWMETI2)
$7N704: R28.1 USB-ISP.1
$7N705: R26.1 U8.12(P3.1/TxD/D+)
$7N706: R27.1 U8.11(P3.0/RxD/D-/INT4)
$7N1635: R22.1 U8.20(P1.0/ADC0/RxD2/PWM1P)
$7N4477: R23.1 U8.19(P1.1/ADC1/TxD2/PWM1N)

Not connected (* = marked no-connect by the designer): AUDIO A8(SBU1)* B8(SBU2)*; POWER A8(SBU1)* B8(SBU2)*; U3 7(BSW)* 12(NC)* 20(NC)*; U4 3(NC)* 7(DNC)*; U5 3(NC)* 7(DNC)*; U9 13(I2C_SLAVE_SDATA _GPIO_A1)* 19(I2S_SCLK_OR _DSD_SCLK_IN)* 20(I2S_SDATA_0_OR _DSD_RIGHT_SDATA_IN)* 21(I2S_SLR_OR _DSD_LEFT_SDATA_IN)* 47(SPDIF_IN)* 48(SPDIF_C_EXT)*

## Notes on the sheets
sheet 1
- 可用：P25Q11H-UXH-IR
- GD25Q40CEIGR
- USB桥
- 连接器
- 供电滤波
sheet 2
- 600R@100MHz
- Cp=6.8μs/Rp
- FB: 1.2408
- 数字LDO
- Cn=7.5μs/Rn
- FB: 1.1094
- 600R@100MHz
- FB: 1.1746
- FB: 1.1746
- GND
- 运放电源
- 主备电切换
sheet 3
- MCU音量软控
- 音量编码器
